# EAGLE design BAL3S (EAGLE 7.5.0)
REVISION: A
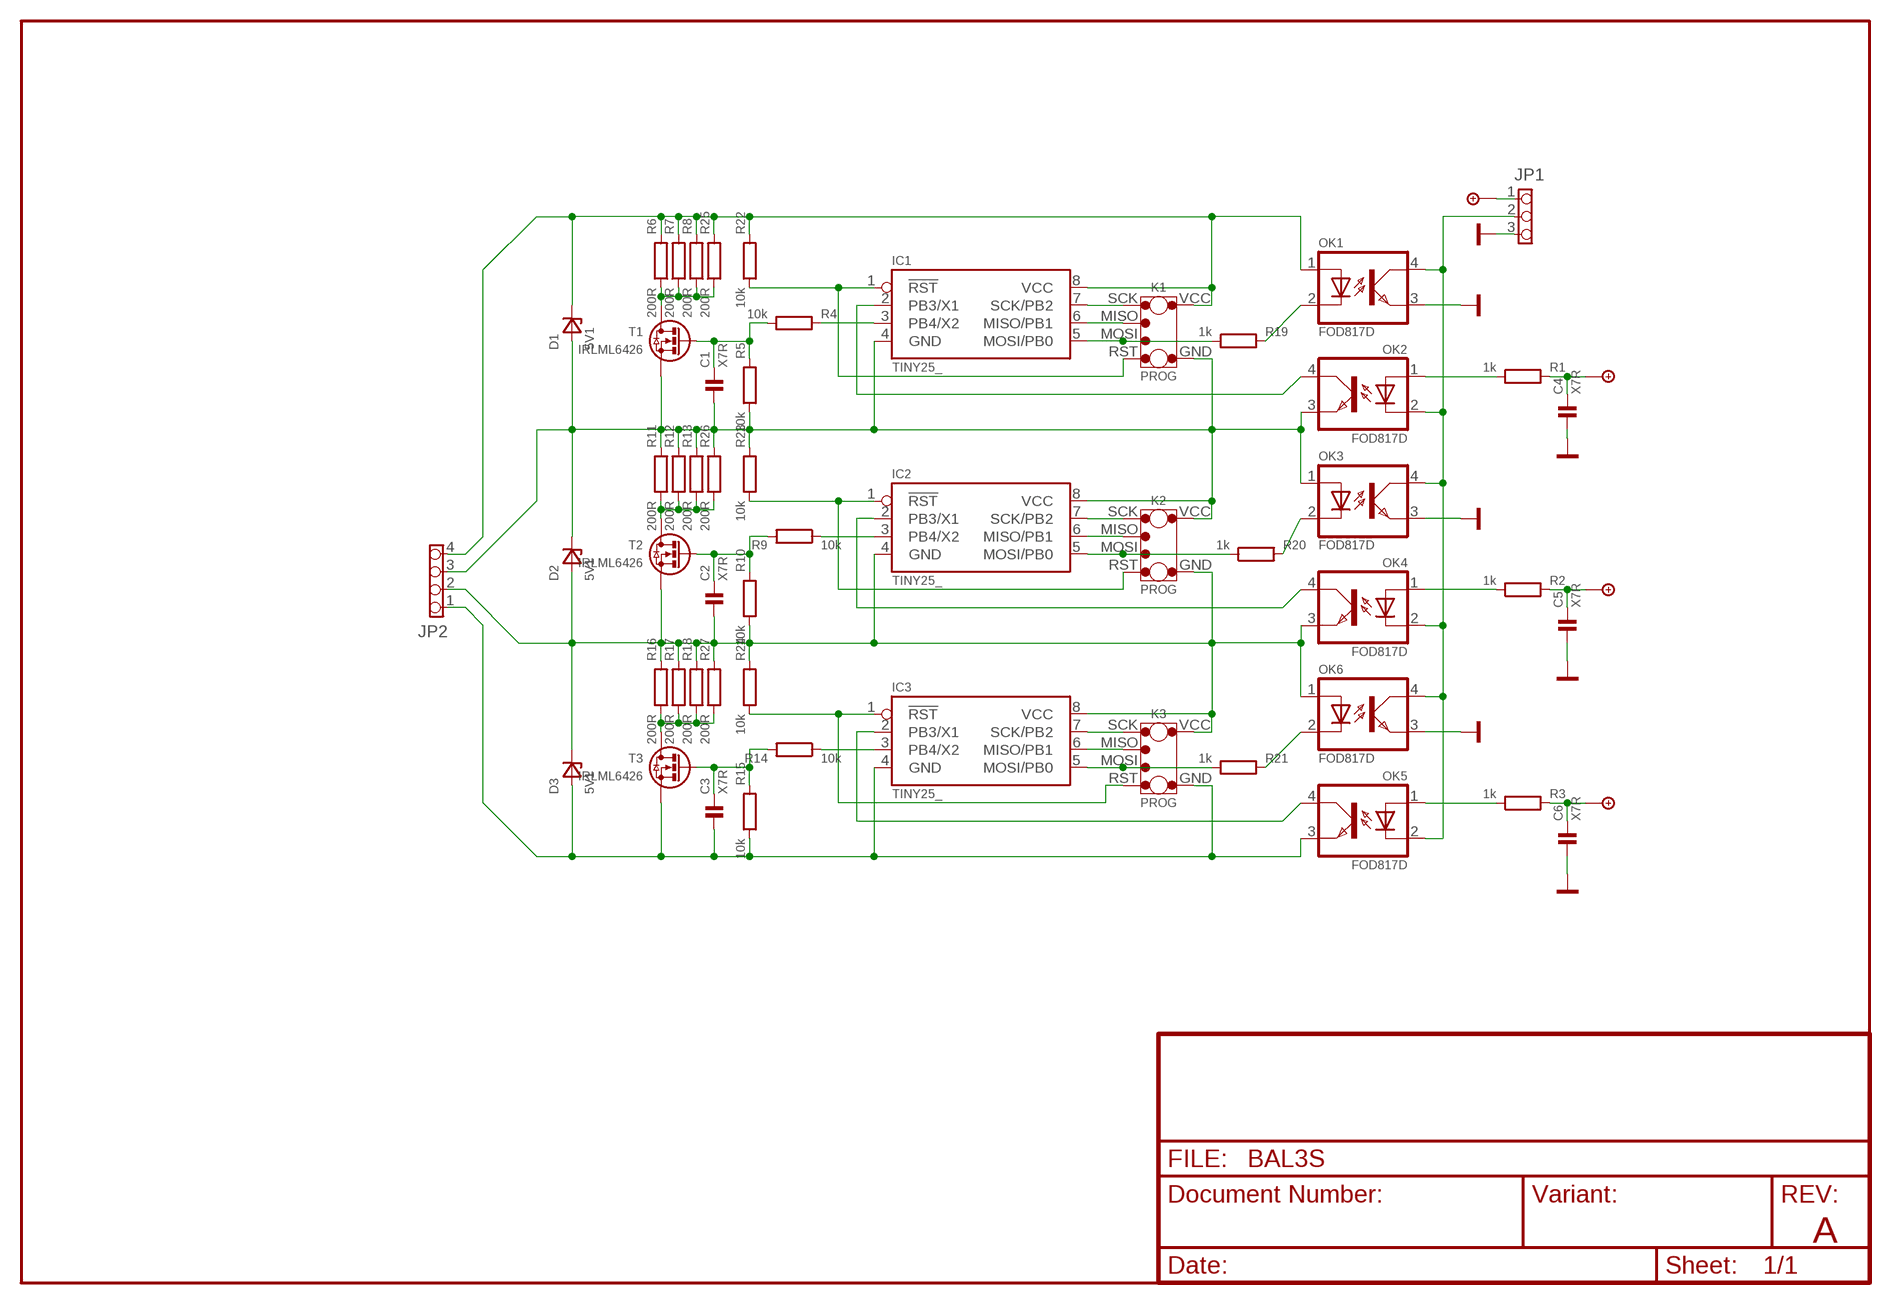
[diagram p0: schematic, sheet 1]

## Parts
C1  C0805  [0805]
C2  C0805  [0805]
C3  C0805  [0805]
C4  C0805  [0805]
C5  C0805  [0805]
C6  C0805  [0805]
D1  5V1  D_ZENER_MLL41  [D_MLL41]
D2  5V1  D_ZENER_MLL41  [D_MLL41]
D3  5V1  D_ZENER_MLL41  [D_MLL41]
IC1  TINY25_  [SO08]
IC2  TINY25_  [SO08]
IC3  TINY25_  [SO08]
JP1  PINHD-1X3_254_EDGE  [1X03_254_EDGE]
JP2  PINHD-1X4_254_EDGE  [1X04_254_EDGE]
K1  PROG  [PROG]
K2  PROG  [PROG]
K3  PROG  [PROG]
OK1  FOD817D  OC_T_NOBASE  [SO04]
OK2  FOD817D  OC_T_NOBASE  [SO04]
OK3  FOD817D  OC_T_NOBASE  [SO04]
OK4  FOD817D  OC_T_NOBASE  [SO04]
OK5  FOD817D  OC_T_NOBASE  [SO04]
OK6  FOD817D  OC_T_NOBASE  [SO04]
R1  1k  R_R0805  [0805]
R2  1k  R_R0805  [0805]
R3  1k  R_R0805  [0805]
R4  10k  R_R0805  [0805]
R5  10k  R_R0805  [0805]
R6  200R  R_R0805  [0805]
R7  200R  R_R0805  [0805]
R8  200R  R_R0805  [0805]
R9  10k  R_R0805  [0805]
R10  10k  R_R0805  [0805]
R11  200R  R_R0805  [0805]
R12  200R  R_R0805  [0805]
R13  200R  R_R0805  [0805]
R14  10k  R_R0805  [0805]
R15  10k  R_R0805  [0805]
R16  200R  R_R0805  [0805]
R17  200R  R_R0805  [0805]
R18  200R  R_R0805  [0805]
R19  1k  R_R0805  [0805]
R20  1k  R_R0805  [0805]
R21  1k  R_R0805  [0805]
R22  10k  R_R0805  [0805]
R23  10k  R_R0805  [0805]
R24  10k  R_R0805  [0805]
R25  200R  R_R0805  [0805]
R26  200R  R_R0805  [0805]
R27  200R  R_R0805  [0805]
T1  IRLML6426  _EMOS_N_SOT23_GDS  [SOT23]
T2  IRLML6426  _EMOS_N_SOT23_GDS  [SOT23]
T3  IRLML6426  _EMOS_N_SOT23_GDS  [SOT23]

## Nets
+5V: C4.1 C5.1 C6.1 JP1.1 R1.2 R2.2 R3.2
GND: C4.2 C5.2 C6.2 JP1.3 OK1.3(EMIT) OK3.3(EMIT) OK6.3(EMIT)
N$1: C1.2 D1.A D2.K IC1.4(GND) IC2.8(VCC) JP2.3 K1.GND K2.VCC OK2.3(EMIT) OK3.1(A) R5.1 R11.2 R12.2 R13.2 R23.2 R26.2 T1.3(S)
N$2: C2.2 D2.A D3.K IC2.4(GND) IC3.8(VCC) JP2.2 K2.GND K3.VCC OK4.3(EMIT) OK6.1(A) R10.1 R16.2 R17.2 R18.2 R24.2 R27.2 T2.3(S)
N$3: C3.2 D3.A IC3.4(GND) JP2.1 K3.GND OK5.3(EMIT) R15.1 T3.3(S)
N$4: IC1.3(PB4/X2) R4.2
N$6: JP1.2 OK1.4(COL) OK2.2(C) OK3.4(COL) OK4.2(C) OK5.2(C) OK6.4(COL)
N$7: OK2.1(A) R1.1
N$8: OK4.1(A) R2.1
N$9: OK5.1(A) R3.1
N$11: C1.1 R4.1 R5.2 T1.1(G)
N$12: IC1.2(PB3/X1) OK2.4(COL)
N$13: IC1.7(SCK/PB2) K1.SCK
N$14: R6.1 R7.1 R8.1 R25.1 T1.2(D)
N$15: C2.1 R9.2 R10.2 T2.1(G)
N$16: D1.K IC1.8(VCC) JP2.4 K1.VCC OK1.1(A) R6.2 R7.2 R8.2 R22.2 R25.2
N$17: IC2.3(PB4/X2) R9.1
N$18: IC2.2(PB3/X1) OK4.4(COL)
N$19: R11.1 R12.1 R13.1 R26.1 T2.2(D)
N$20: IC1.6(MISO/PB1) K1.MISO
N$21: IC3.3(PB4/X2) R14.1
N$22: C3.1 R14.2 R15.2 T3.1(G)
N$23: R16.1 R17.1 R18.1 R27.1 T3.2(D)
N$24: IC1.5(MOSI/PB0) K1.MOSI R19.1
N$25: IC1.1(!RST) K1.RST R22.1
N$26: IC2.7(SCK/PB2) K2.SCK
N$27: IC2.6(MISO/PB1) K2.MISO
N$28: IC2.5(MOSI/PB0) K2.MOSI R20.1
N$29: IC3.7(SCK/PB2) K3.SCK
N$30: IC2.1(!RST) K2.RST R23.1
N$31: IC3.6(MISO/PB1) K3.MISO
N$32: IC3.5(MOSI/PB0) K3.MOSI R21.1
N$33: IC3.1(!RST) K3.RST R24.1
N$34: IC3.2(PB3/X1) OK5.4(COL)
N$35: OK1.2(C) R19.2
N$36: OK3.2(C) R20.2
N$37: OK6.2(C) R21.2

## Library data of the parts
C1-C6 = !discrete:C: Kondenzator; MATERIAL: X7R
D1-D3 = !discrete:D_ZENER: Dioda Zenerova Typ Uzen Izen Pmax Pouzdro ZMMxx-SMD 2,7V...51V 5 mA 500 mW SOD80
IC1-IC3 = !ic_avr:TINY25_: IO - Mikrokontroler AVR
JP1 = !pinhead:PINHD-1X3: Konektor 3 PIN Typ Rastr Imax Umax Rmax Kontakt 2.54 mm 500 mA 125 V 50 mOhm krimp /90 2.54 mm 500 mA 125 V 50 mOhm krimp _MX5267 2.50 mm 2.5 A 250 V 20 mOhm krimp _MX53048 1.25 mm 800 mA 125 V 20 mOhm krimp _PV-3.81 3.81 mm 8 A 130 V 30 mOhm ?roub
JP2 = !pinhead:PINHD-1X4: Konektor 4 PIN Typ Rastr Imax Umax Rmax Kontakt 2.54 mm 500 mA 125 V 50 mOhm krimp /90 2.54 mm 500 mA 125 V 50 mOhm krimp _MX5267 2.50 mm 2.5 A 250 V 20 mOhm krimp _MX53048 1.25 mm 800 mA 125 V 20 mOhm krimp _PV-3.81 3.81 mm 8 A 130 V 30 mOhm ?roub
K1-K3 = !konektor:PROG
OK1-OK6 = !opto:OC_T_NOBASE: Optoclen T bez baze Typ CTR Uiz If Uce Ic Pouzdro PC 111 >50 % 5 kV 5 mA 35 V 50 mA O6 PC 817 >50 % 5 kV 5 mA 35 V 50 mA O2 FOD817 50-600 % 5 kV ? 70 V 50 mA O2 SFH 611-3 100-200 % 2,8 kV 10 mA 70 V 50 mA O3 TLP 124 100-200 % 3,7 kV 50 mA 80 V 50 mA O2
R1-R27 = !discrete:R_: Rezistor
T1-T3 = !transistor:_EMOS_N_: Tranzistor MOSFET - ENHANCED s N kanalem Typ UgsT Uds Id0 Pt rdson Pouzdro BS170 3V 60 V 500 mA 350 mW 1,8 - 5,0 Ohm TO92_SGD IRFZ44N 4V 55 V 49 A 110 W 22 mOhm TO220_GDS IRLR110 2V 100 V 4,3 A 25 W(2.5W) 540 mOhm TO252_GDS IRFP260N 4V 200 V 50 A 300 W 40 mOhm TO247AC_GDS BSS138 1.5V 50 V 220 mA 360 mW 5.8 Ohm SOT23_GDS BSS123 2V 50 V 170 mA 360 mW 10 Ohm SOT23_GDS IRLML6246 [kompl. 2246] 1.1V 30 V 5 A 360 mW 30 mOhm SOT23_GDS

## Board
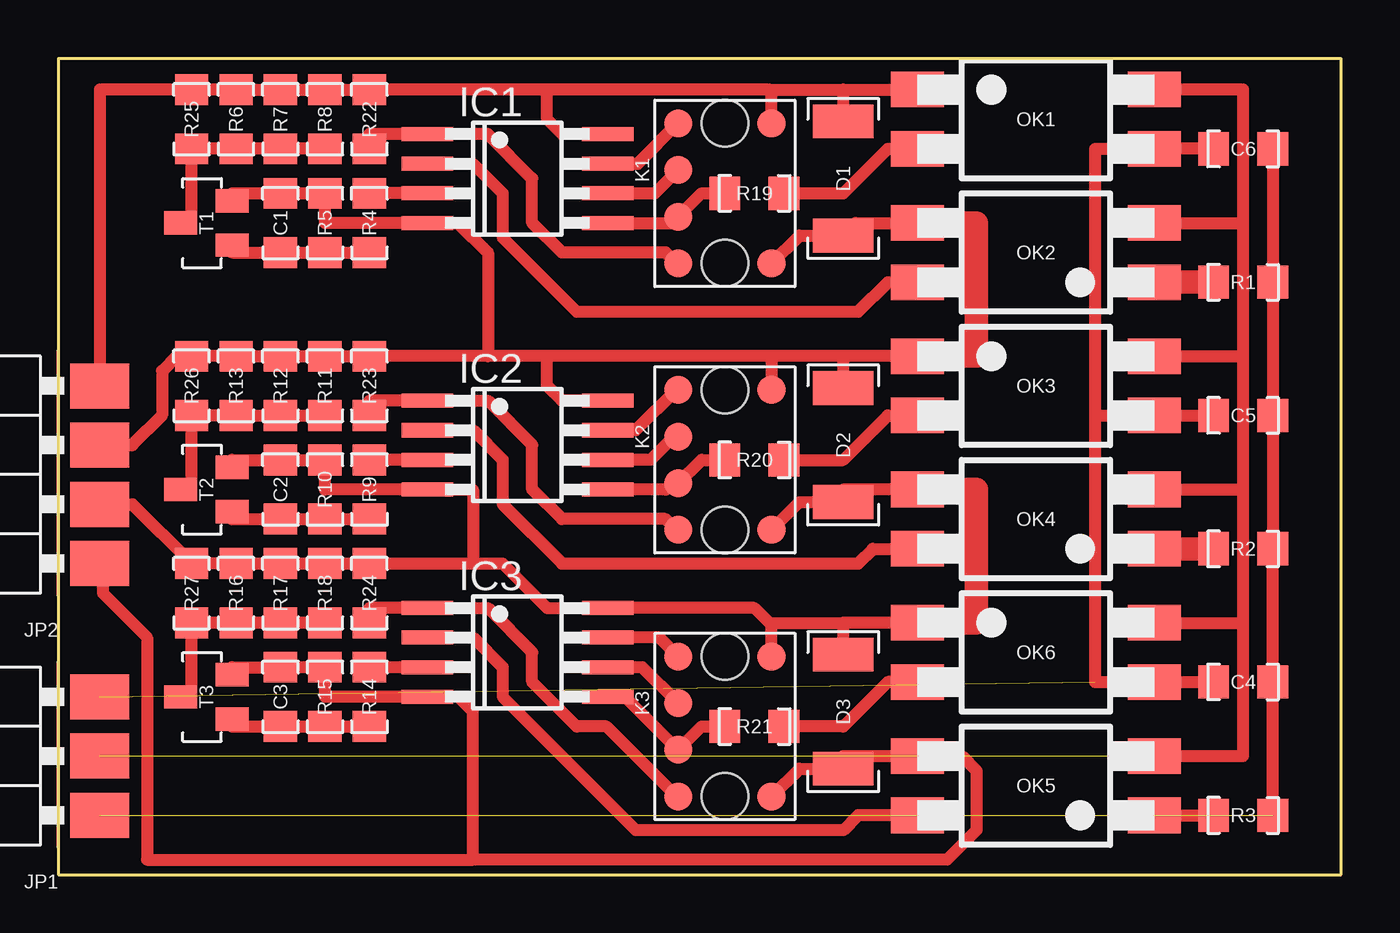
[diagram p1: board, top side]

Size 55 x 35 mm. Coordinates in mm from the lower left corner, seen from the top.
Outline: 0,35 55,35 55,0 0,0 0,35
Copper layers (1*16): Top 0.035mm / dielectric 1.5mm / Bottom 0.035mm
Design rules "default *": minimum track width 10mil, minimum drill 24mil, track to track 8mil, track to pad 8mil, pad to pad 8mil, via to via 8mil, smd to smd 8mil, copper to edge 1mil, drill to drill 8mil, minimum pad ring 10mil, minimum via ring 8mil, stop-mask expansion 4mil, vias tented up to drill 0mil, thermal gap 10mil

### Footprints (pad centres in the part's own frame; a part is rotated, then mirrored left to right if it is on the bottom)
0805 = smd 1.321 x 1.422: 1 -1.27,0; 2 1.27,0
D_MLL41 = smd 1.45 x 2.6: A 2.445,0; K -2.445,0
SO08 = smd 0.6 x 2.2: 1 -2.54,-3.87; 2 -1.27,-3.87; 3 0,-3.87; 4 1.27,-3.87; 5 1.27,3.87; 6 0,3.87; 7 -1.27,3.87; 8 -2.54,3.87
1X03_254_EDGE = smd 1.93 x 2.54: 1 -2.54,-1.778; 2 0,-1.778; 3 2.54,-1.778
1X04_254_EDGE = smd 1.93 x 2.54: 1 -2.54,-1.778; 2 0,-1.778; 3 2.54,-1.778; 4 5.08,-1.778
PROG = smd 1.2 x 1.2: GND 2,-3; MISO -2,1; MOSI -2,-1; RST -2,-3; SCK -2,3; VCC 2,3 | hole 2: 0,3; 0,-3
SO04 = smd 2.286 x 1.524: 1 -5.08,1.27; 2 -5.08,-1.27; 3 5.08,-1.27; 4 5.08,1.27
SOT23 = smd 1 x 1.4: 1 -0.95,-1.1; 2 0,1.1; 3 0.95,-1.1

### Placement (x,y rotation side)
C1  9.53,27.94 90 top
C2  9.53,16.51 90 top
C3  9.53,7.62 90 top
C4  50.8,8.26 180 top
C5  50.8,19.68 180 top
C6  50.8,31.11 180 top
D1  33.66,29.84 270 top
D2  33.66,18.41 270 top
D3  33.66,6.99 270 top
IC1  19.68,29.21 270 top
IC2  19.68,17.78 270 top
IC3  19.68,8.89 270 top
JP1  0,5.08 90 top
JP2  0,15.88 90 top
K1  28.57,29.21 0 top
K2  28.57,17.78 0 top
K3  28.57,6.35 0 top
OK1  41.91,32.38 0 top
OK2  41.91,26.67 180 top
OK3  41.91,20.95 0 top
OK4  41.91,15.24 180 top
OK5  41.91,3.81 180 top
OK6  41.91,9.53 0 top
R1  50.8,25.4 0 top
R2  50.8,13.97 0 top
R3  50.8,2.54 0 top
R4  13.34,27.94 90 top
R5  11.43,27.94 270 top
R6  7.62,32.38 90 top
R7  9.53,32.38 90 top
R8  11.43,32.38 90 top
R9  13.34,16.51 270 top
R10  11.43,16.51 270 top
R11  11.43,20.95 90 top
R12  9.53,20.95 90 top
R13  7.62,20.95 90 top
R14  13.34,7.62 270 top
R15  11.43,7.62 270 top
R16  7.62,12.06 90 top
R17  9.53,12.06 90 top
R18  11.43,12.06 90 top
R19  29.84,29.21 0 top
R20  29.84,17.78 0 top
R21  29.84,6.35 0 top
R22  13.34,32.38 90 top
R23  13.34,20.95 90 top
R24  13.34,12.06 90 top
R25  5.71,32.38 90 top
R26  5.71,20.95 90 top
R27  5.71,12.06 90 top
T1  6.35,27.94 90 top
T2  6.35,16.51 90 top
T3  6.35,7.62 90 top

### Tracks (layer width: path | path; a pad name or v marks a point on that pad's centre or on a via)
+5V  (1 unrouted)
  Top 0.508: R3.2 C4.1 R2.2 C5.1 R1.2 C6.1
GND  (1 unrouted)
  Top 0.508: C6.2 OK1.3 44.45,31.11 44.45,19.68 | C5.2 OK3.3 44.45,19.68 | 44.45,19.68 44.45,8.26 OK6.3 C4.2
N$1
  Top 0.508: T1.3 7.45,29.21 C1.2 R5.1 11.43,27.94 IC1.4 17.14,27.94 18.41,26.67 18.41,22.23 | 30.57,22.23 K2.VCC | OK3.1 33.66,22.23 | 33.66,22.23 30.57,22.23 | D2.K 33.66,22.23 | OK2.3 34.2,27.94 D1.A 31.77,27.4 K1.GND | 30.57,22.23 20.95,22.23 | 20.95,22.23 18.41,22.23 | 18.41,22.23 R23.2 R11.2 R12.2 R13.2 R26.2 5.08,22.23 4.45,21.59 4.45,19.68 3.17,18.41 JP2.3 | IC2.8 21.59,20.32 20.95,20.95 20.95,22.23
  Top 1.016: OK2.3 39.37,27.94 39.37,22.23 OK3.1
N$2
  Top 0.508: 17.78,13.34 R24.2 R18.2 R17.2 R16.2 R27.2 3.17,15.88 JP2.2 | 17.78,13.34 19.05,13.34 20.95,11.43 IC3.8 29.84,11.43 30.48,10.79 | T2.3 7.45,17.78 C2.2 R10.1 11.43,16.51 IC2.4 17.78,16.51 17.78,13.34 | 30.48,10.79 33.66,10.79 | OK6.1 33.66,10.79 | K3.VCC 30.57,10.7 30.48,10.79 | D3.K 33.66,10.79 | OK4.3 33.66,16.51 D2.A 31.77,15.97 K2.GND
  Top 1.016: OK6.1 39.37,10.79 39.37,16.51 OK4.3
N$3
  Top 0.508: T3.3 7.45,8.89 C3.2 R15.1 11.43,7.62 IC3.4 17.14,7.62 17.78,6.99 17.78,0.64 | 17.78,0.64 38.1,0.64 39.37,1.91 39.37,4.45 38.73,5.08 OK5.3 33.66,5.08 D3.A 31.77,4.54 K3.GND | JP2.1 1.91,13.34 1.91,12.06 3.81,10.16 3.81,0.64 17.78,0.64
N$4
  Top 0.508: IC1.3 R4.2
N$6  (1 unrouted)
  Top 0.508: OK5.2 50.8,5.08 50.8,10.79 | 50.8,10.79 50.8,16.51 | 50.8,16.51 50.8,22.23 | 50.8,22.23 50.8,27.94 | 50.8,27.94 50.8,33.66 OK1.4 | OK2.2 50.8,27.94 | OK3.4 50.8,22.23 | OK4.2 50.8,16.51 | OK6.4 50.8,10.79
N$7
  Top 1.016: R1.1 OK2.1
N$8
  Top 1.016: R2.1 OK4.1
N$9
  Top 0.508: OK5.1 R3.1
N$11
  Top 0.508: R4.1 R5.2 C1.1 7.45,26.67 T1.1
N$12
  Top 0.508: IC1.2 17.78,30.48 19.05,29.21 19.05,27.3 22.23,24.13 34.29,24.13 35.56,25.4 OK2.4
N$13
  Top 0.508: 26.4,32.38 K1.SCK 24.84,30.48 IC1.7
N$14
  Top 0.508: R8.1 R7.1 R6.1 R25.1 5.71,27.94 T1.2
N$15
  Top 0.508: T2.1 7.45,15.24 C2.1 R10.2 R9.2
N$16
  Top 0.508: 30.48,33.66 33.66,33.66 | 33.66,33.66 OK1.1 | K1.VCC 30.57,33.56 30.48,33.66 | D1.K 33.66,33.66 | 30.48,33.66 20.95,33.66 | 20.95,33.66 R22.2 R8.2 R7.2 R6.2 R25.2 1.78,33.66 JP2.4 | IC1.8 21.59,31.75 20.95,32.38 20.95,33.66
N$17
  Top 0.508: IC2.3 R9.1
N$18
  Top 0.508: IC2.2 17.78,19.05 19.05,17.78 19.05,15.88 21.59,13.34 34.29,13.34 34.92,13.97 OK4.4
N$19
  Top 0.508: R11.1 R12.1 R13.1 R26.1 5.71,16.51 T2.2
N$20
  Top 0.508: IC1.6 25.57,29.21 K1.MISO
N$21
  Top 0.508: IC3.3 R14.1
N$22
  Top 0.508: T3.1 7.45,6.35 C3.1 R15.2 R14.2
N$23
  Top 0.508: R18.1 R17.1 R16.1 R27.1 5.71,7.62 T3.2
N$24
  Top 0.508: R19.1 27.57,29.21 K1.MOSI 26.3,27.94 IC1.5
N$25
  Top 0.508: R22.1 13.34,31.75 IC1.1 15.81,31.69 16.51,31.75 18.41,31.75 20.32,29.84 20.32,27.94 21.59,26.67 26.04,26.67 26.5,26.21 K1.RST
N$26
  Top 0.508: K2.SCK 26.5,20.78 24.77,19.05 IC2.7
N$27
  Top 0.508: K2.MISO 26.4,18.78 25.4,17.78 IC2.6 22.86,17.78
N$28
  Top 0.508: R20.1 27.57,17.78 K2.MOSI 26.3,16.78 26.04,16.51 IC2.5
N$29
  Top 0.508: K3.SCK 25.77,10.16 IC3.7
N$30
  Top 0.508: R23.1 13.34,20.32 IC2.1 18.41,20.32 20.32,18.41 20.32,16.51 21.59,15.24 26.04,15.24 26.5,14.78 K2.RST
N$31
  Top 0.508: K3.MISO 25.04,8.89 IC3.6
N$32
  Top 0.508: R21.1 27.57,6.35 K3.MOSI 24.3,7.62 IC3.5
N$33
  Top 0.508: R24.1 13.34,11.43 IC3.1 18.41,11.43 20.32,9.53 20.32,8.26 22.23,6.35 23.5,6.35 26.5,3.35 K3.RST
N$34
  Top 0.508: IC3.2 17.78,10.16 19.05,8.89 19.05,7.62 24.77,1.91 33.66,1.91 34.29,2.54 OK5.4
N$35
  Top 0.508: R19.2 33.66,29.21 35.56,31.11 OK1.2
N$36
  Top 0.508: R20.2 33.66,17.78 35.56,19.68 OK3.2
N$37
  Top 0.508: OK6.2 35.56,8.26 33.66,6.35 R21.2